# Altium project LTC1661_UPGRADE.PrjPcb
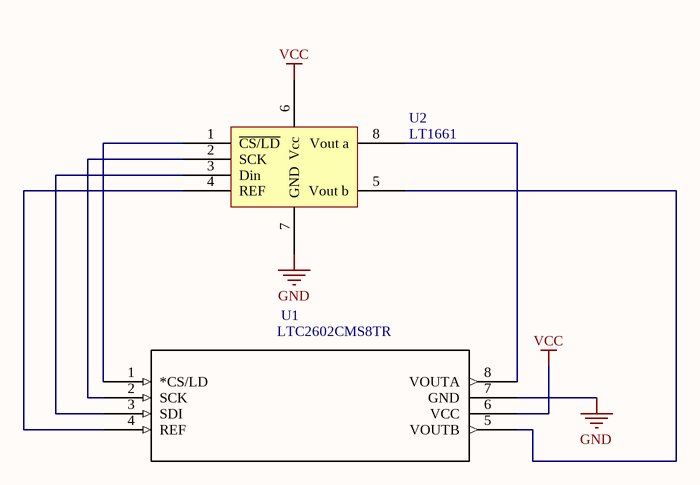
[diagram p0: Sheet1.SchDoc]
1 sheet, 2 parts. Net scope: global (net labels, ports and power ports of the same name join across sheets).
Board file: PCB1.PcbDoc

## Sheet Sheet1.SchDoc
size A

### Parts
U1  LTC2602CMS8TR  [MSOP-8_MS]
U2  LT1661  [DIP-8]

### Nets
GND: U1.7(GND) U2.7(GND)
VCC: U1.6(VCC) U2.6(Vcc)
NetU1_1: U1.1(*CS/LD) U2.1(~{CS/LD})
NetU1_2: U1.2(SCK) U2.2(SCK)
NetU1_3: U1.3(SDI) U2.3(Din)
NetU1_4: U1.4(REF) U2.4(REF)
NetU1_5: U1.5(VOUTB) U2.5(Vout_b)
NetU1_8: U1.8(VOUTA) U2.8(Vout_a)

### Library data of the parts
U1 = LTC2602CMS8TR: Ic Dac 16bit Dual r-r Vout 8msop; MF: Linear Technology; MP: LTC2602CMS8#TR; Availability: Unavailable; Package: MSOP-8 Linear Technology; Price: None; Value: *